# Altium schematic sheet Connectors.SchDoc: Connectors
size Letter; Date: Jul 31/2018; Revision: 1; SheetNumber: 4; SheetTotal: 9
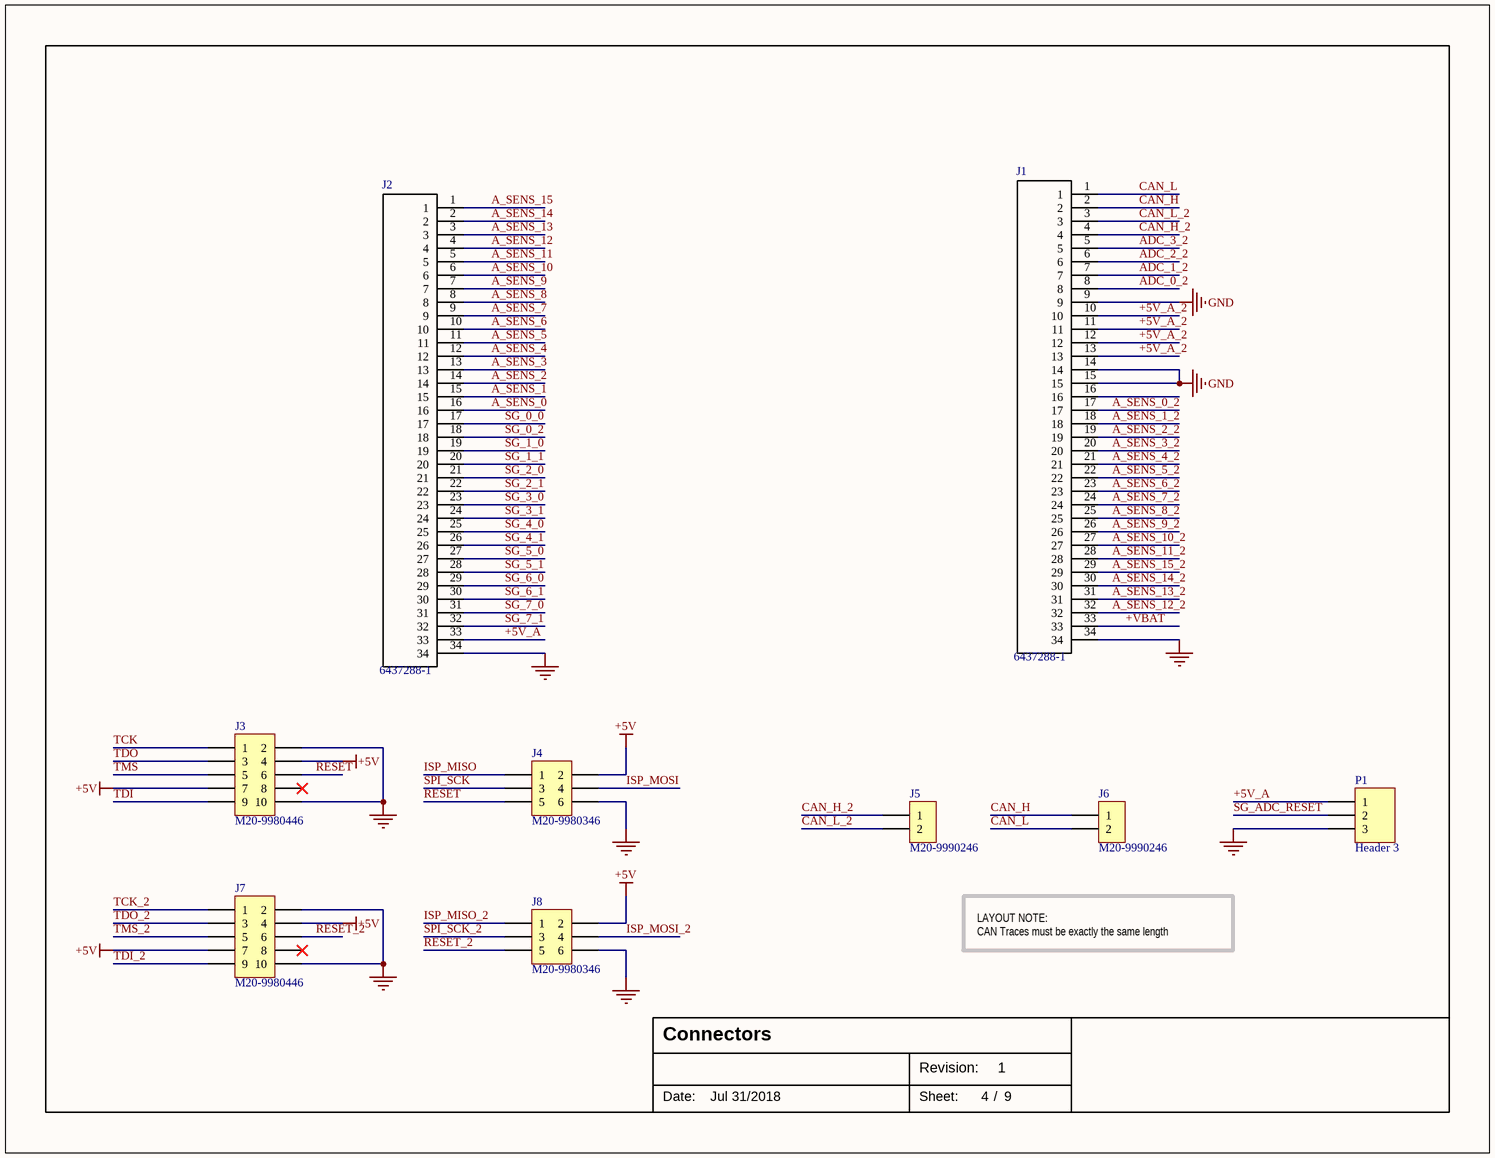
[diagram p0: Connectors.SchDoc]

## Parts
J1  6437288-1  [TE_6437288-1]
J2  6437288-1  [TE_6437288-1]
J3  M20-9980446  [M20-9980446]
J4  M20-9980346  [M20-9980346]
J5  M20-9990246  [M20-9990246]
J6  M20-9990246  [M20-9990246]
J7  M20-9980446  [M20-9980446]
J8  M20-9980346  [M20-9980346]
P1  Header 3  [HDR1X3]

## Nets
+5V: J3.4 J3.7 J4.2 J7.4 J7.7 J8.2
GND: J1.9 J1.14 J1.15 J1.34 J2.34 J3.2 J3.10 J4.6 J7.2 J7.10 J8.6 P1.3
+5V_A: J2.33 P1.1
+5V_A_2: J1.10 J1.11 J1.12 J1.13
+VBAT: J1.33
A_SENS_0: J2.16
A_SENS_0_2: J1.17
A_SENS_1: J2.15
A_SENS_1_2: J1.18
A_SENS_2: J2.14
A_SENS_2_2: J1.19
A_SENS_3: J2.13
A_SENS_3_2: J1.20
A_SENS_4: J2.12
A_SENS_4_2: J1.21
A_SENS_5: J2.11
A_SENS_5_2: J1.22
A_SENS_6: J2.10
A_SENS_6_2: J1.23
A_SENS_7: J2.9
A_SENS_7_2: J1.24
A_SENS_8: J2.8
A_SENS_8_2: J1.25
A_SENS_9: J2.7
A_SENS_9_2: J1.26
A_SENS_10: J2.6
A_SENS_10_2: J1.27
A_SENS_11: J2.5
A_SENS_11_2: J1.28
A_SENS_12: J2.4
A_SENS_12_2: J1.32
A_SENS_13: J2.3
A_SENS_13_2: J1.31
A_SENS_14: J2.2
A_SENS_14_2: J1.30
A_SENS_15: J2.1
A_SENS_15_2: J1.29
ADC_0_2: J1.8
ADC_1_2: J1.7
ADC_2_2: J1.6
ADC_3_2: J1.5
CAN_H: J1.2 J6.1
CAN_H_2: J1.4 J5.1
CAN_L: J1.1 J6.2
CAN_L_2: J1.3 J5.2
ISP_MISO: J4.1
ISP_MISO_2: J8.1
ISP_MOSI: J4.4
ISP_MOSI_2: J8.4
RESET: J3.6 J4.5
RESET_2: J7.6 J8.5
SG_0_0: J2.17
SG_0_2: J2.18
SG_1_0: J2.19
SG_1_1: J2.20
SG_2_0: J2.21
SG_2_1: J2.22
SG_3_0: J2.23
SG_3_1: J2.24
SG_4_0: J2.25
SG_4_1: J2.26
SG_5_0: J2.27
SG_5_1: J2.28
SG_6_0: J2.29
SG_6_1: J2.30
SG_7_0: J2.31
SG_7_1: J2.32
SG_ADC~{_RESET}: P1.2
SPI_SCK: J4.3
SPI_SCK_2: J8.3
TCK: J3.1
TCK_2: J7.1
TDI: J3.9
TDI_2: J7.9
TDO: J3.3
TDO_2: J7.3
TMS: J3.5
TMS_2: J7.5

Not connected (* = marked no-connect by the designer): J1 16; J3 8*; J7 8*

## Notes on the sheet
- LAYOUT NOTE:
  CAN Traces must be exactly the same length
- Date:
- Revision:
- Sheet:
- /

## Library data of the parts
J1 J2 = 6437288-1: 34 Position 4 Row Right Angle Receptacle Through Hole Super Seal Cap Assy; MF: TE Connectivity; SnapEDA_Link: https://www.snapeda.com/parts/6437288-1/TE%20Connectivity%20AMP%20Connectors/view-part/?ref=snap; Link: http://www.te.com/usa-en/product-6437288-1.html; Digi-Key_Part_Number: A124384-ND; EU_RoHS_Compliance: Compliant; Digi-Key_Purchase_URL: https://www.digikey.ca/product-detail/en/te-connectivity-amp-connectors/6437288-1/A124384-ND/5428601?utm_source=snapeda&utm_medium=aggregator&utm_campaign=symbol; MP: 6437288-1; Package: None; Value: *
J3 J7 = M20-9980446: 2.54mm Header 2x4-Pin
J4 J8 = M20-9980346: 2.54mm Header 2x3-Pin; Supplier 1: Digi-Key; Supplier Part Number 1: 952-2121-ND
J5 J6 = M20-9990246: 2.54mm Header 1x2-Pin; Supplier 1: Digi-Key; Supplier Part Number 1: 952-2262-ND
P1 = Header 3: Header, 3-Pin; LatestRevisionDate: 17-Jul-2002; LatestRevisionNote: Re-released for DXP Platform.; Publisher: Altium Limited